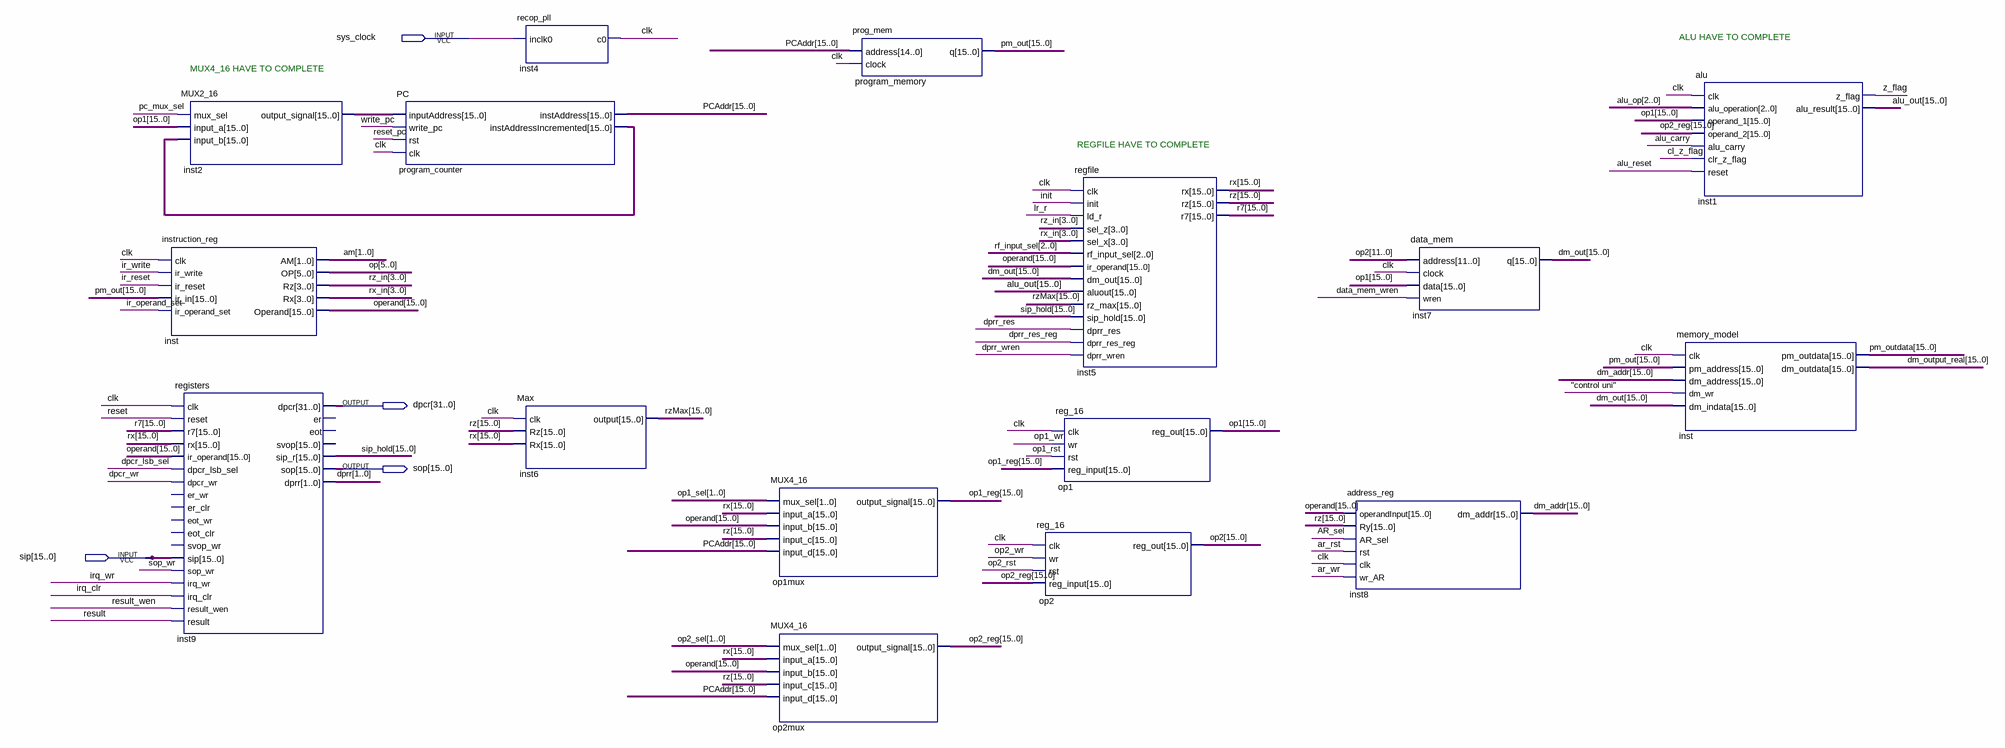
[diagram p0: schematic sheet]
// Quartus schematic RecopBlockDiagram.bdf as structural Verilog: 16 symbols, 4 pins
module RecopBlockDiagram (
  input  sys_clock,
  input  [15:0] sip,
  output [31:0] dpcr,
  output [15:0] sop
);

  wire \"control_uni" , alu_carry, alu_reset, ar_rst, AR_sel, ar_wr, cl_z_flag, clk, data_mem_wren,
       dpcr_lsb_sel, dpcr_wr, dprr_res, dprr_res_reg, dprr_wren, init, ir_operand_set, ir_reset, ir_write,
       irq_clr, irq_wr, lr_r, \op1_reg{15..0] , op1_rst, op1_wr, \op2_reg{15..0] , op2_rst, op2_wr,
       pc_mux_sel, reset, reset_pc, result, result_wen, sop_wr, write_pc, z_flag;
  wire [1:0] am, dprr, op1_sel, op2_sel;
  wire [2:0] alu_op, rf_input_sel;
  wire [3:0] rx_in, rz_in;
  wire [5:0] op;
  wire [15:0] alu_out, dm_addr, dm_out, dm_output_real, inst2_output_signal, op1, op2, operand, PCAddr,
       pm_out, pm_outdata, program_counter_instaddressincremented, r7, rx, rz, rzMax, sip_hold;

  instruction_reg inst (
    .clk(clk), .ir_write(ir_write), .ir_reset(ir_reset), .ir_in(pm_out), .ir_operand_set(ir_operand_set),
    .AM(am), .OP(op), .Rz(rz_in), .Rx(rx_in), .Operand(operand));
  registers inst9 (
    .clk(clk), .reset(reset), .r7(r7), .rx(rx), .ir_operand(operand), .dpcr_lsb_sel(dpcr_lsb_sel),
    .dpcr_wr(dpcr_wr), .sip(sip), .sop_wr(sop_wr), .irq_wr(irq_wr), .irq_clr(irq_clr),
    .result_wen(result_wen), .result(result), .dpcr(dpcr), .sip_r(sip_hold), .sop(sop), .dprr(dprr));  // open: er_wr, er_clr, eot_wr, eot_clr, svop_wr, er, eot, svop
  MUX2_16 inst2 (
    .mux_sel(pc_mux_sel), .input_a(op1), .input_b(program_counter_instaddressincremented),
    .output_signal(inst2_output_signal));
  PC program_counter (
    .inputAddress(inst2_output_signal), .write_pc(write_pc), .rst(reset_pc), .clk(clk), .instAddress(PCAddr),
    .instAddressIncremented(program_counter_instaddressincremented));
  recop_pll inst4 (.inclk0(sys_clock), .c0(clk));
  Max inst6 (.clk(clk), .Rz(rz), .Rx(rx), .\output (rzMax));
  MUX4_16 op1mux (
    .mux_sel(op1_sel), .input_a(rx), .input_b(operand), .input_c(rz), .input_d(PCAddr),
    .output_signal(\op1_reg{15..0] ));
  MUX4_16 op2mux (
    .mux_sel(op2_sel), .input_a(rx), .input_b(operand), .input_c(rz), .input_d(PCAddr),
    .output_signal(\op2_reg{15..0] ));
  prog_mem program_memory (.address(PCAddr), .clock(clk), .q(pm_out));
  reg_16 u_op2 (.clk(clk), .wr(op2_wr), .rst(op2_rst), .reg_input({16{\op2_reg{15..0] }}), .reg_out(op2));
  regfile inst5 (
    .clk(clk), .init(init), .ld_r(lr_r), .sel_z(rz_in), .sel_x(rx_in), .rf_input_sel(rf_input_sel),
    .ir_operand(operand), .dm_out(dm_out), .aluout(alu_out), .rz_max(rzMax), .sip_hold(sip_hold),
    .dprr_res(dprr_res), .dprr_res_reg(dprr_res_reg), .dprr_wren(dprr_wren), .rx(rx), .rz(rz), .r7(r7));
  reg_16 u_op1 (.clk(clk), .wr(op1_wr), .rst(op1_rst), .reg_input({16{\op1_reg{15..0] }}), .reg_out(op1));
  address_reg inst8 (
    .operandInput(operand), .Ry(rz), .AR_sel(AR_sel), .rst(ar_rst), .clk(clk), .wr_AR(ar_wr),
    .dm_addr(dm_addr));
  data_mem inst7 (.address(op2[11:0]), .clock(clk), .data(op1), .wren(data_mem_wren), .q(dm_out));
  alu inst1 (
    .clk(clk), .alu_operation(alu_op), .operand_1(op1), .operand_2({16{\op2_reg{15..0] }}),
    .alu_carry(alu_carry), .clr_z_flag(cl_z_flag), .reset(alu_reset), .z_flag(z_flag), .alu_result(alu_out));
  memory_model inst_dup2 (
    .clk(clk), .pm_address(pm_out), .dm_address(dm_addr), .dm_wr(\"control_uni" ), .dm_indata(dm_out),
    .pm_outdata(pm_outdata), .dm_outdata(dm_output_real));

  // Notes on the sheet:
  //   ALU HAVE TO COMPLETE
  //   MUX4_16 HAVE TO COMPLETE
  //   REGFILE HAVE TO COMPLETE
endmodule
